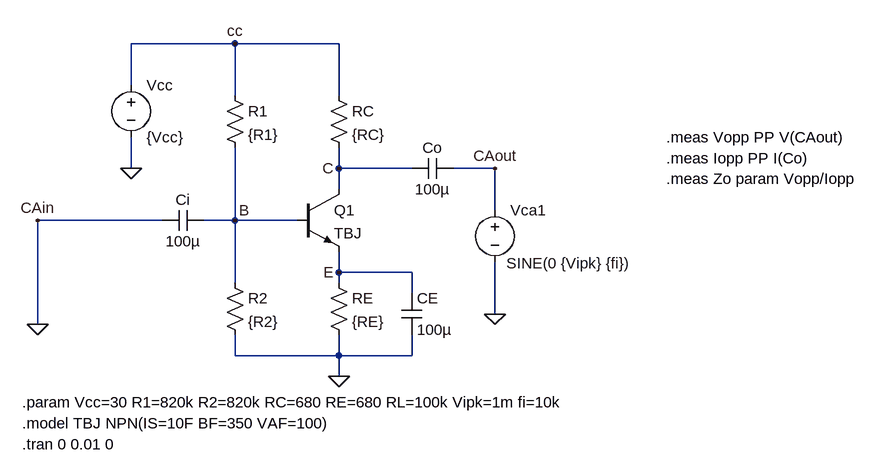
[diagram p0: schematic TBJ02CAZo.asc]
TBJ02CAZo.asc, the LTspice schematic file:
Version 4
SHEET 1 1608 1200
WIRE 128 -16 -32 -16
WIRE 288 -16 128 -16
WIRE -32 48 -32 -16
WIRE 128 64 128 -16
WIRE 288 64 288 -16
WIRE -32 176 -32 128
WIRE 288 176 288 144
WIRE 400 176 288 176
WIRE 528 176 464 176
WIRE 288 208 288 176
WIRE 528 240 528 176
WIRE 16 256 -176 256
WIRE 128 256 128 144
WIRE 128 256 80 256
WIRE 224 256 128 256
WIRE 288 336 288 304
WIRE 400 336 288 336
WIRE 128 352 128 256
WIRE 288 352 288 336
WIRE 400 368 400 336
WIRE 528 400 528 320
WIRE -176 416 -176 256
WIRE 128 464 128 432
WIRE 288 464 288 432
WIRE 288 464 128 464
WIRE 400 464 400 432
WIRE 400 464 288 464
WIRE 288 496 288 464
FLAG -32 176 0
FLAG 288 496 0
FLAG -176 416 0
FLAG 128 -16 cc
FLAG -176 256 CAin
FLAG 528 400 0
FLAG 528 176 CAout
FLAG 128 256 B
FLAG 288 176 C
FLAG 288 336 E
SYMBOL res 112 48 R0
SYMATTR InstName R1
SYMATTR Value {R1}
SYMBOL res 272 48 R0
SYMATTR InstName RC
SYMATTR Value {RC}
SYMBOL voltage -32 32 R0
WINDOW 123 0 0 Left 0
WINDOW 39 0 0 Left 0
SYMATTR InstName Vcc
SYMATTR Value {Vcc}
SYMBOL npn 224 208 R0
SYMATTR InstName Q1
SYMATTR Value TBJ
SYMBOL cap 80 240 R90
WINDOW 0 0 32 VBottom 2
WINDOW 3 32 32 VTop 2
SYMATTR InstName Ci
SYMATTR Value 100µ
SYMBOL cap 464 160 R90
WINDOW 0 0 32 VBottom 2
WINDOW 3 32 32 VTop 2
SYMATTR InstName Co
SYMATTR Value 100µ
SYMBOL res 272 336 R0
SYMATTR InstName RE
SYMATTR Value {RE}
SYMBOL cap 384 368 R0
SYMATTR InstName CE
SYMATTR Value 100µ
SYMBOL res 112 336 R0
SYMATTR InstName R2
SYMATTR Value {R2}
SYMBOL voltage 528 224 R0
WINDOW 123 0 0 Left 0
WINDOW 39 0 0 Left 0
WINDOW 3 18 98 Left 2
SYMATTR InstName Vca1
SYMATTR Value SINE(0 {Vipk} {fi})
TEXT -200 536 Left 2 !.param Vcc=30 R1=820k R2=820k RC=680 RE=680 RL=100k Vipk=1m fi=10k
TEXT -200 568 Left 2 !.model TBJ NPN(IS=10F BF=350 VAF=100)
TEXT -200 600 Left 2 !.tran 0 0.01 0
TEXT 792 128 Left 2 !.meas Vopp PP V(CAout)
TEXT 792 160 Left 2 !.meas Iopp PP I(Co)
TEXT 792 192 Left 2 !.meas Zo param Vopp/Iopp

The netlist it stands for:
* TBJ02CAZo.asc
R1 cc B {R1}
RC cc C {RC}
Vcc cc 0 {Vcc}
Q1 C B E 0 TBJ
Ci B 0 100µ
Co CAout C 100µ
RE E 0 {RE}
CE E 0 100µ
R2 B 0 {R2}
Vca1 CAout 0 SINE(0 {Vipk} {fi})
.model NPN NPN
.model PNP PNP
.lib standard.bjt
.param Vcc=30 R1=820k R2=820k RC=680 RE=680 RL=100k Vipk=1m fi=10k
.model TBJ NPN(IS=10F BF=350 VAF=100)
.tran 0 0.01 0
.meas Vopp PP V(CAout)
.meas Iopp PP I(Co)
.meas Zo param Vopp/Iopp
.backanno
.end